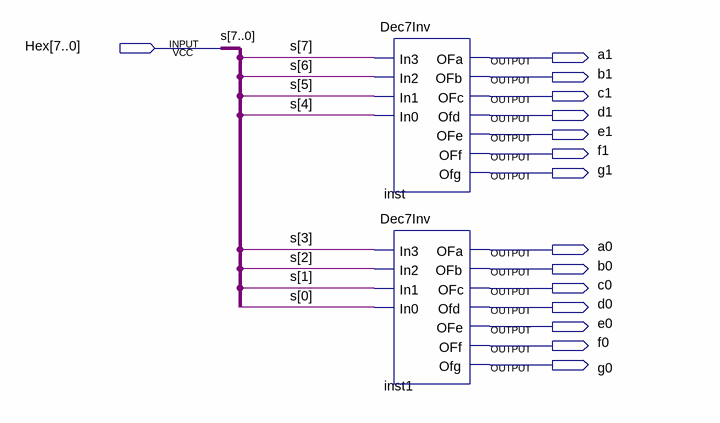
[diagram p0: schematic sheet]
// Quartus schematic 2Dec7Inv.bdf as structural Verilog: 2 symbols, 15 pins
module \2Dec7Inv  (
  input  [7:0] Hex,
  output a1,
  output b1,
  output c1,
  output d1,
  output e1,
  output f1,
  output g1,
  output a0,
  output b0,
  output c0,
  output d0,
  output e0,
  output f0,
  output g0
);

  Dec7Inv inst (
    .In3(Hex[7]), .In2(Hex[6]), .In1(Hex[5]), .In0(Hex[4]), .OFa(a1), .OFb(b1), .OFc(c1), .Ofd(d1), .OFe(e1),
    .OFf(f1), .Ofg(g1));
  Dec7Inv inst1 (
    .In3(Hex[3]), .In2(Hex[2]), .In1(Hex[1]), .In0(Hex[0]), .OFa(a0), .OFb(b0), .OFc(c0), .Ofd(d0), .OFe(e0),
    .OFf(f0), .Ofg(g0));

  // Other names for the same wires on the sheet: s[7:0] = Hex
endmodule
